# EasyEDA Pro project Buzzer DIY Kit.eprj

# Schematic Buzzer DIY Kit PV1
Board Name: PV1; Create Date: 2025-12-22; Page Name: P1; Project Name: Buzzer DIY Kit; Schematic Name: Schematic1; Update Date: 2025-12-23; Company: m039; Drawn: Dmitry Mozgin; Page Size: A4; Version: V1.0
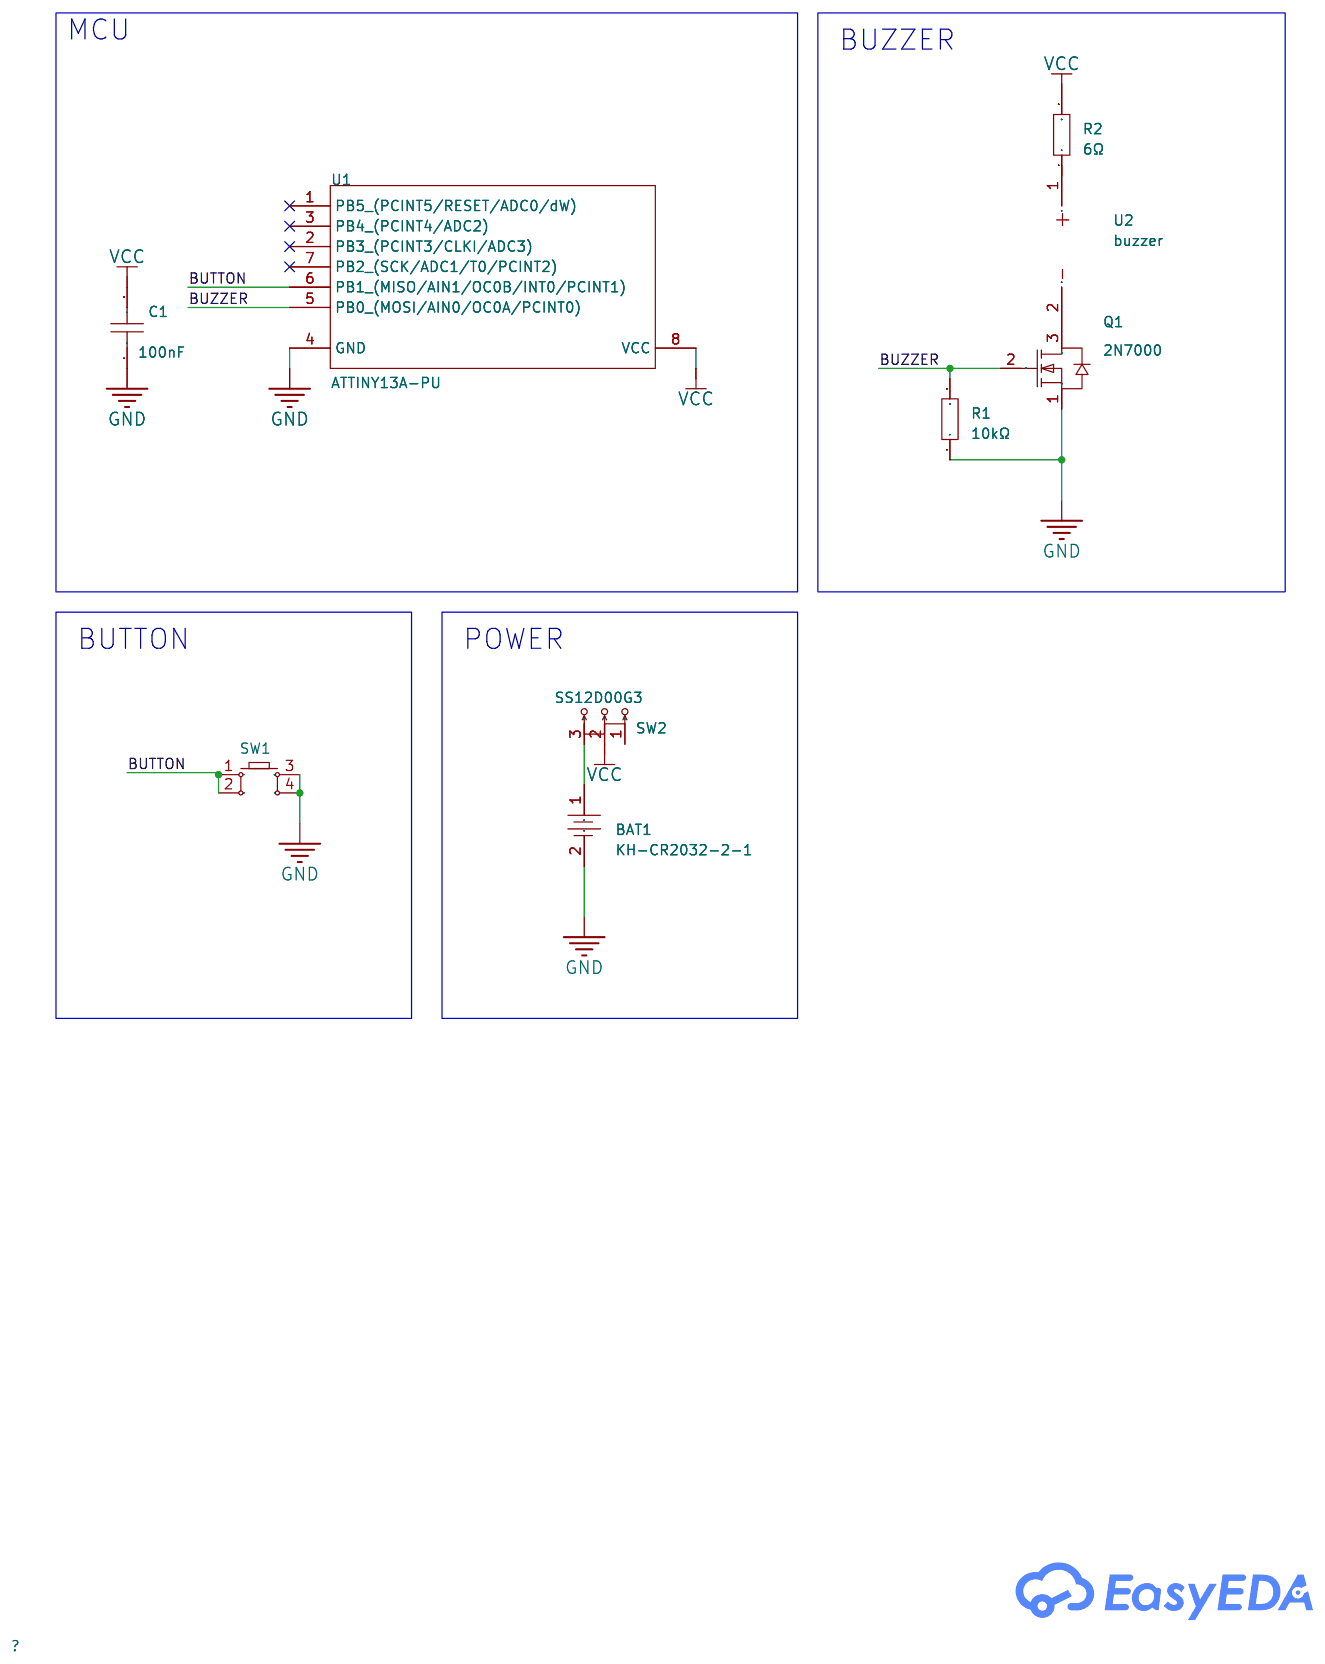
[diagram p0: schematic sheet]

## Parts
BAT1  KH-CR2032-2-1  [BAT-TH_KH-CR2032-2-1]
C1  100nF  [CAP-TH_L4.8-W2.4-P5.08-D0.6]
Q1  2N7000  [TO-92-3_L4.9-W3.7-P1.27-L]
R1  10kΩ  [RES-TH_BD1.8-L3.2-P7.20-D0.4]
R2  6Ω  [RES-TH_BD1.8-L3.2-P7.20-D0.4]
SW1  -  [KEY-TH_4P-L6.0-W6.0-P3.90-LS6.5]
SW2  SS12D00G3  [SW-TH_SS-12D01-GX]
U1  ATTINY13A-PU  [DIP-8_L9.3-W6.4-P2.54-LS7.6-BL-1]
U2  buzzer  [HC9042-03-CLDZ-ELECTROMAGNETIC PASSIVE INTEGRATED BUZZER-3V(9×4.2MM)]

## Library data of the parts
BAT1 = KH-CR2032-2-1: Supplier Part: C5365915; Manufacturer: kinghelm(金航标); JLCPCB Part Class: Extended Part; Datasheet: https://atta.szlcsc.com/upload/public/pdf/source/20230301/F3ED62C53898C1F99BC47B7A2E148BA2.pdf; Supplier: LCSC
C1 = CC1H221KC1EDB44B1100: LCSC Part Name: 220pF ±10% 50V; Supplier Part: C2832511; Manufacturer: Dersonic(德尔创); Supplier Footprint: 插件,P=5.08mm; JLCPCB Part Class: Extended Part; Datasheet: https://atta.szlcsc.com/upload/public/pdf/source/20211103/ADF2DBCED823A6AEFAA1F6C91B9CD8F4.pdf; Supplier: LCSC; Tolerance: ±10%; Voltage Rating: 50V; Pin Spacing: 5.08mm; Temperature Coefficient: Y5P; Diameter: 4.8mm; Body Thickness: 2.4mm
Q1 = 2N7000: LCSC Part Name: 1个N沟道 耐压:60V 电流:200mA; Supplier Part: C232838; Manufacturer: onsemi(安森美); Supplier Footprint: TO-92-3; JLCPCB Part Class: Extended Part; Datasheet: https://atta.szlcsc.com/upload/public/pdf/source/20221020/6B07E43F0B4B9B39AB447A9A1885F5BD.pdf; Supplier: LCSC; Type: 1 N-Channel; Drain Source On Resistance (RDS(on)@Vgs,Id): 5Ω@10V,500mA; Gate Threshold Voltage (Vgs(th)@Id): 3V@1mA
R1 R2 = Res_AXIAL-1/8W: Supplier Footprint: Through
SW1 = Key_TH_6x6x4.5: Supplier Footprint: Through
SW2 = SS12D00G3: Supplier Part: C9900018735; Supplier Footprint: SW-TH; JLCPCB Part Class: Extended Part; Supplier: LCSC
U1 = ATTINY13A-PU: Supplier Part: C94341; Manufacturer: MICROCHIP(美国微芯); Supplier Footprint: DIP-8; JLCPCB Part Class: Extended Part; Datasheet: https://item.szlcsc.com/datasheet/ATTINY13A-PU/95539.html; Supplier: LCSC; CPU Core: AVR; CPU Maximum Speed: 20MHz; Program Storage Size: 1KB; Number of I/O: 6; ADC (Bit): 10bit; Voltage - Supply: 1.8V~5.5V
U2 = buzzer: Supplier: Vaibhion; link: https://robu.in/product/hc9042-03-cldz-electromagnetic-passive-integrated-buzzer-3v9x4-2mmimpedance16%cf%89/

## Nets
GND: BAT1.2 C1.1 Q1.1(S) R1.1 SW1.3 SW1.4 U1.4(GND)
VCC: C1.2 R2.2 SW2.2 U1.8(VCC)
BUTTON: SW1.1 SW1.2 U1.6(PB1 (MISO/AIN1/OC0B/INT0/PCINT1))
BUZZER: Q1.2(G) R1.2 U1.5(PB0 (MOSI/AIN0/OC0A/PCINT0))
$1N612: R2.1 U2.1
$1N645: Q1.3(D) U2.2
$1N678: BAT1.1 SW2.3

Not connected (* = marked no-connect by the designer): SW2 1; U1 1(PB5 (PCINT5/RESET/ADC0/dW))* 2(PB3 (PCINT3/CLKI/ADC3))* 3(PB4 (PCINT4/ADC2))* 7(PB2 (SCK/ADC1/T0/PCINT2))*

## Notes on the sheet
- MCU
- BUZZER
- BUTTON
- POWER

# Board PCB2
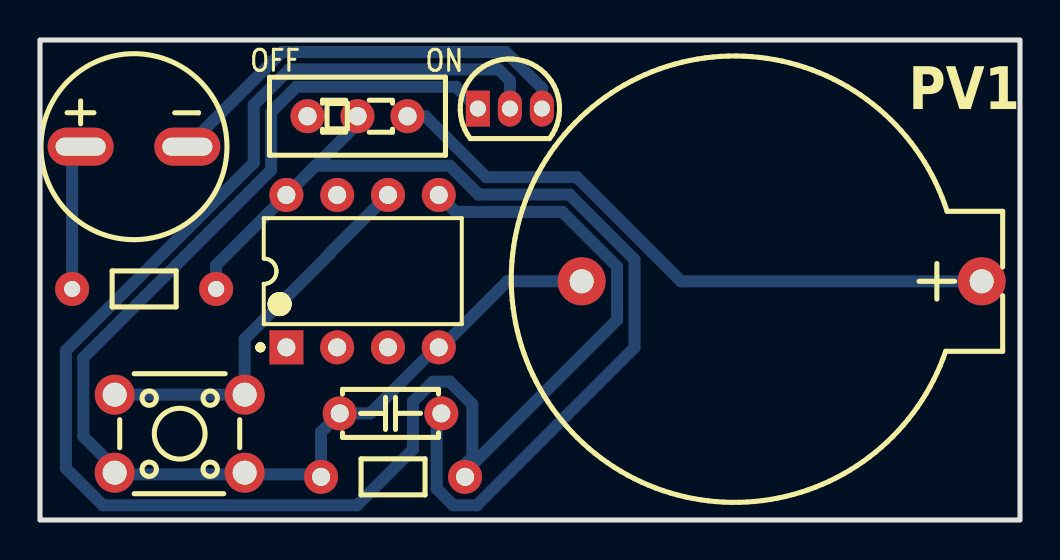
[diagram p1: board, top side]
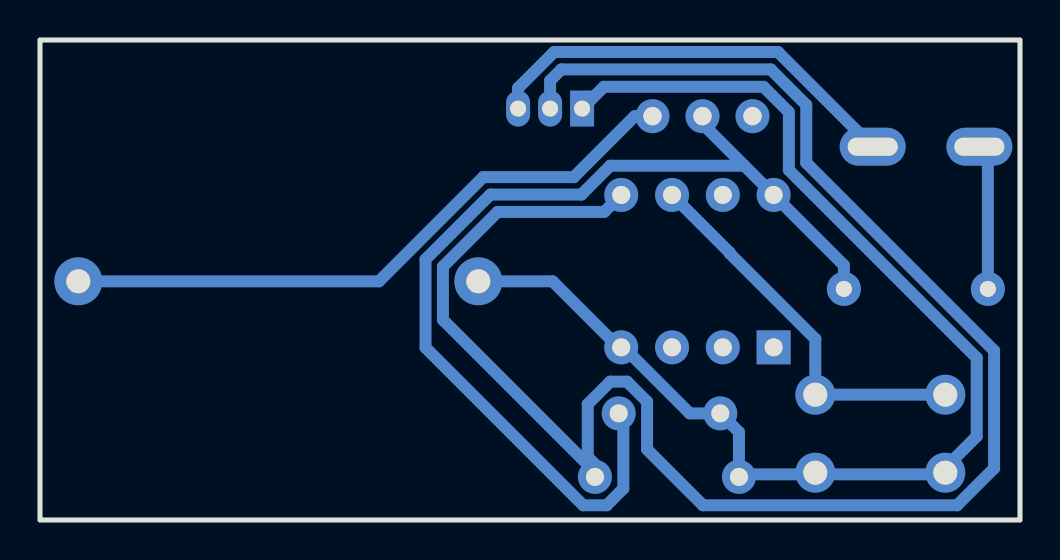
[diagram p2: board, bottom side, seen from below]

Outline 49 x 24 mm; copper layers: Top Layer, Bottom Layer. Coordinates in mm from the lower left corner of the outline.
Outline path: rectangle 0,24 49,0
Stack: Top Layer 0.035mm / Dielectric1 1.51mm FR4 er 4.5 / Bottom Layer 0.035mm

## Design rules (mm)
template: Custom Config
spacing copperThickness1oz (default): track to track 0.27, other pairs 0.152 to 0.3
spacing copperThickness2oz: track to track 0.203, other pairs 0.152 to 0.3
track width copperThickness1oz (default): min 0.127, default 0.6, max 2.54
track width copperThickness2oz: min 0.203, default 0.254, max 2.54
differential pair differentialPair (default): width min 0.127, default 0.254, max 2.54; gap min 0.152, default 0.152
via viaSize (default): diameter min 0.5, default 0.61, max 10; hole min 0.3, default 0.305, max 6.3

## Placement (name value [footprint] x y rotation side)
BAT1  KH-CR2032-2-1  [BAT-TH_KH-CR2032-2-1]  37.08 11.94 0 top
C1  100nF  [CAP-TH_L4.8-W2.4-P5.08-D0.6]  17.53 5.33 0 top
Q1  2N7000  [TO-92-3_L4.9-W3.7-P1.27-L]  23.5 20.57 0 top
R1  10kΩ  [RES-TH_BD1.8-L3.2-P7.20-D0.4]  17.65 2.16 0 top
R2  6Ω  [RES-TH_BD1.8-L3.2-P7.20-D0.4#2]  5.21 11.55 0 top
SW1  -  [KEY-TH_4P-L6.0-W6.0-P3.90-LS6.5]  6.98 4.31 0 top
SW2  SS12D00G3  [SW-TH_SS-12D01-GX]  15.88 20.19 0 top
U1  ATTINY13A-PU  [DIP-8_L9.3-W6.4-P2.54-LS7.6-BL-1]  16.13 12.44 0 top
U2  buzzer  [HC9042-03-CLDZ-ELECTROMAGNETIC PASSIVE INTEGRATED BUZZER-3V(9×4.2MM)]  4.7 18.67 0 top

## Footprints (pads in the part's own frame, mm; a bottom-side part is the same pattern mirrored in y, then rotated)
BAT-TH_KH-CR2032-2-1
  round 2.4 hole 1.2x0.9: 1(10,0) 2(-10,0)
CAP-TH_L4.8-W2.4-P5.08-D0.6
  round 1.7 hole 0.9: 1(-2.54,0) 2(2.54,0)
DIP-8_L9.3-W6.4-P2.54-LS7.6-BL-1
  rect 1.7x1.7 hole 0.9: 1(-3.81,-3.81)
  round 1.7 hole 0.9: 2(-1.27,-3.81) 3(1.27,-3.81) 4(3.81,-3.81) 5(3.81,3.81) 6(1.27,3.81) 7(-1.27,3.81) 8(-3.81,3.81)
HC9042-03-CLDZ-ELECTROMAGNETIC PASSIVE INTEGRATED BUZZER-3V(9×4.2MM)
  oval 3.3x1.9 hole 2.5x0.9: 1(-2.667,0) 2(2.667,0)
KEY-TH_4P-L6.0-W6.0-P3.90-LS6.5
  round 2 hole 1.2: 1(-3.25,1.95) 2(3.25,1.95) 3(-3.25,-1.95) 4(3.25,-1.95)
RES-TH_BD1.8-L3.2-P7.20-D0.4
  round 1.7 hole 0.9: 1(-3.6,0) 2(3.6,0)
RES-TH_BD1.8-L3.2-P7.20-D0.4#2
  round 1.7 hole 0.8: 1(-3.6,0) 2(3.6,0)
SW-TH_SS-12D01-GX
  round 1.7 hole 0.914: 1(-2.5,0) 2(0,0) 3(2.5,0)
TO-92-3_L4.9-W3.7-P1.27-L
  rect 1.2x1.8 hole 0.8: 1(-1.6,0)
  oval 1.2x1.8 hole 0.8: 2(0,0) 3(1.6,0)

## Nets
As in the schematic.

Pads without a net: SW2 1; U1 1 2 3 7

## Routing (per net, layer and track width the routed paths; a pad name or vN(x,y) marks a point on that pad's centre or on a via; arc(x,y) is an arc through that point)
GND: length 62.8
  Bottom Layer w0.6: 20.07,8.89 16.51,5.33 C1.1 14.05,4.4 14.05,2.41 ; 3.99,2.75 3.6,2.75 2.17,4.18 2.17,8.11 11.56,17.5 11.56,20.4 12.82,21.66 20.81,21.66 Q1.1 ; 3.99,2.75 4.45,2.28 13.93,2.28 14.05,2.41 ; 3.99,2.75 3.99,2.62 ; R1.1 14.05,2.41 ; 20.07,8.63 23.37,11.94 BAT1.2
VCC: length 51.2
  Bottom Layer w0.6: C1.2 19.83,5.1 19.83,1.57 20.66,0.74 21.84,0.74 29.72,8.62 29.72,13.03 26.48,16.27 21.93,16.27 20.49,17.71 13.78,17.71 ; 13.78,17.71 15.88,19.81 SW2.2 ; 13.78,17.71 U1.8 8.81,12.74 R2.2
BUTTON: length 19.5
  Bottom Layer w0.6: U1.6 14.51,13.37 14.51,13.33 10.24,9.05 SW1.2 SW1.1
BUZZER: length 90.2
  Bottom Layer w0.6: Q1.2 23.5,21.97 22.93,22.53 12.46,22.53 10.69,20.76 10.69,17.86 1.3,8.47 1.3,2.58 3.14,0.74 15.85,0.74 18.65,3.53 18.65,5.92 19.64,6.92 20.49,6.92 21.61,5.79 21.61,3.15 21.06,2.6 21.25,2.41 28.85,10.01 28.85,12.67 26.12,15.4 20.79,15.4 U1.5
$1N612: length 7.3
  Bottom Layer w0.6: U2.1 1.61,18.24 R2.1
$1N645: length 21.5
  Bottom Layer w0.6: U2.2 12.1,23.4 23.29,23.4 25.09,21.6 Q1.3
$1N678: length 32.1
  Bottom Layer w0.6: SW2.3 19.26,20.19 22.31,17.14 26.84,17.14 32.05,11.94 BAT1.1

## Text on the board
Top Silkscreen Layer: OFF | ON | PV1
